# EAGLE design ATEx_2016 (EAGLE 7.5.0)
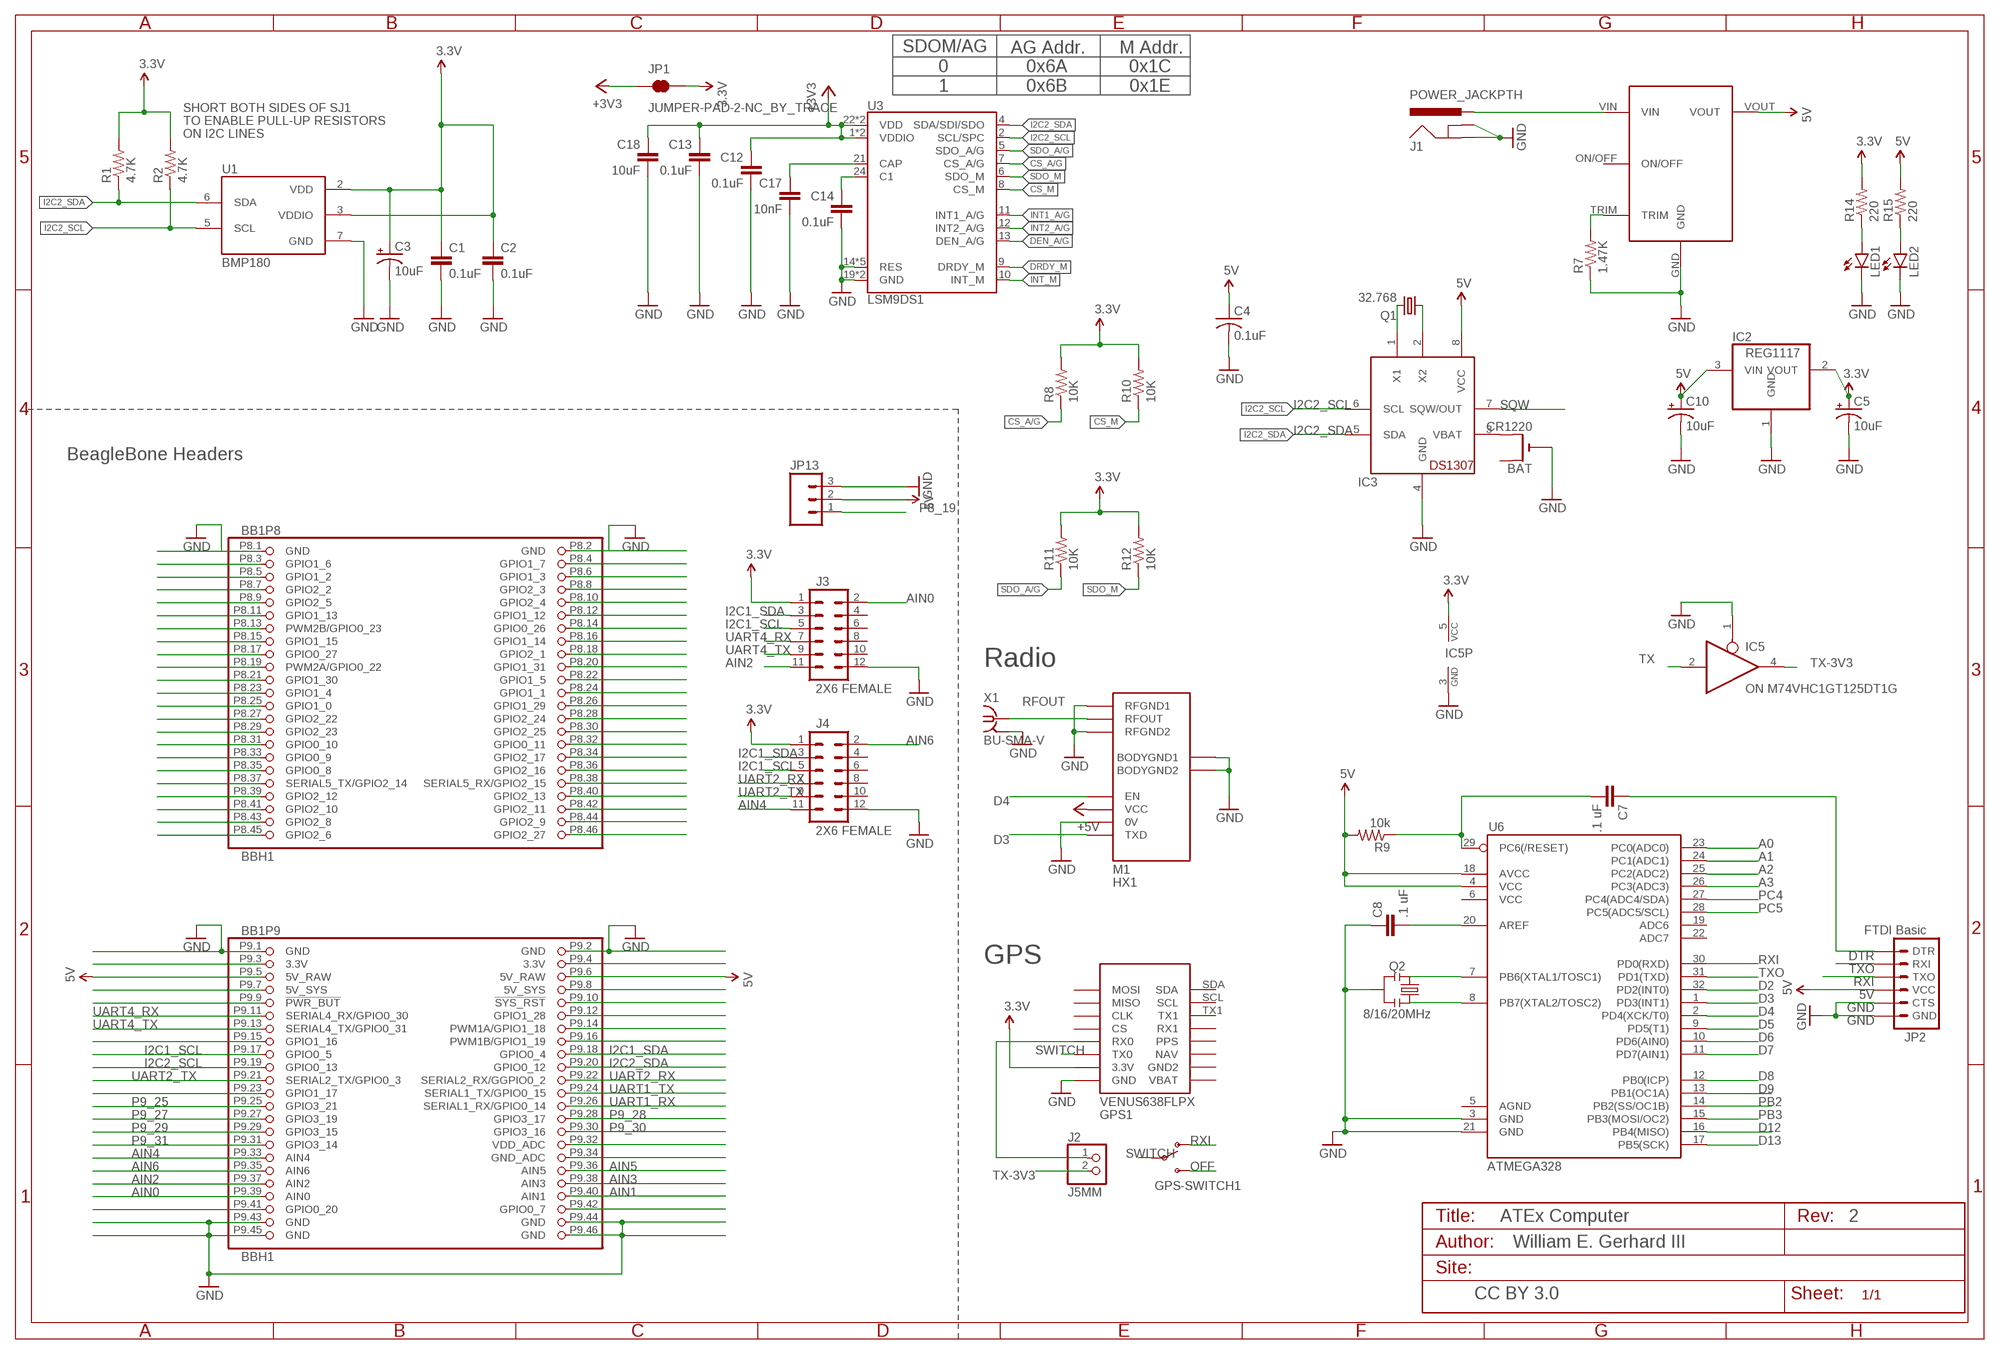
[diagram p0: schematic, sheet 1]

## Parts
BAT  CR1220  CR1220THM  [CR1220-THM]
BB1  BBH1  [BB_CAPE]
C1  0.1uF  CAP0603-CAP  [0603-CAP]
C2  0.1uF  CAP0603-CAP  [0603-CAP]
C3  10uF  10UF-16V-10%(TANT)  [EIA3216]
C4  0.1uF  C-USC0603  [C0603]
C5  10uF  CAP_POL1206  [EIA3216]
C7  .1 uF  CAP0603-CAP  [0603-CAP]
C8  .1 uF  CAP0603-CAP  [0603-CAP]
C10  10uF  CAP_POL1206  [EIA3216]
C12  0.1uF  0.1UF-25V(+80/-20%)(0603)  [0603-CAP]
C13  0.1uF  0.1UF-25V(+80/-20%)(0603)  [0603-CAP]
C14  0.1uF  0.1UF-25V(+80/-20%)(0603)  [0603-CAP]
C17  10nF  10NF/10000PF-50V-10%(0603)  [0603-CAP]
C18  10uF  10UF-6.3V-20%(0603)  [0603-CAP]
GPS1  VENUS638FLPX  [VENUS638FLPX]
GPS-SWITCH1  SWITCH-SPSTPTH  [SWITCH-SPDT]
IC2  REG1117  [SOT223]
IC3  DS1307  [DIL08]
IC5  ON M74VHC1GT125DT1G  74AHC1G125DBV  [SOT23-5]
J1  POWER_JACKPTH  [POWER_JACK_PTH]
J2  J5MM  PINHD-1X2  [1X02]
J3  2X6 FEMALE  M06X2PTH_FEMALE  [2X6]
J4  2X6 FEMALE  M06X2PTH_FEMALE  [2X6]
JP1  JUMPER-PAD-2-NC_BY_TRACE  [PAD-JUMPER-2-NC_BY_TRACE_YES_SILK]
JP2  FTDI Basic  ARDUINO_SERIAL_PROGRAMPTH  [1X06]
JP13  M03PTH  [1X03]
LED1  LED-FKIT-1206  [FKIT-LED-1206]
LED2  LED-FKIT-1206  [FKIT-LED-1206]
M1  HX1  [HX1]
Q1  32.768  CRYTALTC38H  [TC38H]
Q2  8/16/20MHz  RESONATORSMD  [RESONATOR-SMD]
R1  4.7K  RESISTOR0603-RES  [0603-RES]
R2  4.7K  RESISTOR0603-RES  [0603-RES]
R7  1.47K  R-US_R0603  [R0603]
R8  10K  10KOHM-1/10W-1%(0603)0603  [0603-RES]
R9  10k  RESISTOR0603-RES  [0603-RES]
R10  10K  10KOHM-1/10W-1%(0603)0603  [0603-RES]
R11  10K  10KOHM-1/10W-1%(0603)0603  [0603-RES]
R12  10K  10KOHM-1/10W-1%(0603)0603  [0603-RES]
R14  220  R0603  [R0603]
R15  220  R0603  [R0603]
U1  BMP180  [BMP180]
U3  LSM9DS1  [LGA24-8X4]
U6  ATMEGA328  ATMEGA168  [TQFP32-08]
U$1  DNT12S0A0S03NFA  [SMD]
X1  BU-SMA-V  [BU-SMA-V]

## Nets
3.3V [vcc]: C1.1 C2.1 C3.A(+) C5.A(+) GPS1.3.3V IC2.2(VOUT) IC5.5(VCC) J3.1 J4.1 JP1.2 R1.2 R2.2 R8.2 R10.2 R11.2 R12.2 R14.2 U1.2(VDD) U1.3(VDDIO)
3VOLT: LED1.A R14.1
5V [vcc]: BB1.P9.5(P9:5V_RAW) BB1.P9.6(P9:5V_RAW) C4.1 C10.A(+) IC2.3(VIN) IC3.8(VCC) JP2.4(VCC) JP13.2 R9.2 R15.2 U6.4(VCC) U6.18(AVCC) U$1.VOUT
5VOLT: LED2.A R15.1
+3V3: C12.1 C13.1 C18.1 JP1.1 U3.1(VDDIO) U3.3(VDDIO) U3.22(VDD) U3.23(VDD)
+5V: M1.VCC
A0: U6.23(PC0(ADC0))
A1: U6.24(PC1(ADC1))
A2: U6.25(PC2(ADC2))
A3: U6.26(PC3(ADC3))
AIN0: BB1.P9.39(P9:AIN0) J3.2
AIN1: BB1.P9.40(P9:AIN1)
AIN2: BB1.P9.37(P9:AIN2) J3.11
AIN3: BB1.P9.38(P9:AIN3)
AIN4: BB1.P9.33(P9:AIN4) J4.11
AIN5: BB1.P9.36(P9:AIN5)
AIN6: BB1.P9.35(P9:AIN6) J4.2
C2: C14.1 U3.24(C1)
CAP1: C17.1 U3.21(CAP)
CS_A/G: R8.1 U3.7(CS_A/G)
CS_M: R10.1 U3.8(CS_M)
D2: U6.32(PD2(INT0))
D3 [RF]: M1.TXD U6.1(PD3(INT1))
D4: M1.EN U6.2(PD4(XCK/T0))
D5: U6.9(PD5(T1))
D6: U6.10(PD6(AIN0))
D7: U6.11(PD7(AIN1))
D8: U6.12(PB0(ICP))
D9: U6.13(PB1(OC1A))
D12: U6.16(PB4(MISO))
D13: U6.17(PB5(SCK))
DEN_A/G: U3.13(DEN_A/G)
DRDY_M: U3.9(DRDY_M)
DTR: C7.1 JP2.1(DTR)
GND [vcc]: BAT.- BB1.P8.1(P8:GND) BB1.P8.2(P8:GND) BB1.P9.1(P9:GND) BB1.P9.2(P9:GND) BB1.P9.43(P9:GND) BB1.P9.44(P9:GND) BB1.P9.45(P9:GND) BB1.P9.46(P9:GND) C1.2 C2.2 C3.C(-) C4.2 C5.C(-) C8.1 C10.C(-) C12.2 C13.2 C14.2 C17.2 C18.2 GPS1.GND IC2.1(GND) IC3.4(GND) IC5.1(OE) J1.GND J1.GNDBREAK J3.12 J4.12 JP2.5(CTS) JP2.6(GND) JP13.3 LED1.C LED2.C M1.0V M1.BODYGND1 M1.BODYGND2 M1.RFGND1 M1.RFGND2 Q2.2 R7.1 U1.7(GND) U3.14(RES) U3.15(RES) U3.16(RES) U3.17(RES) U3.18(RES) U3.19(GND) U3.20(GND) U6.3(GND) U6.21(GND) U$1.GND X1.2(GND)
I2C1_SCL: BB1.P9.17(P9:GPIO0_5) J3.5 J4.5
I2C1_SDA: BB1.P9.18(P9:GPIO0_4) J3.3 J4.3
I2C2_SCL: BB1.P9.19(P9:GPIO0_13) IC3.6(SCL) R2.1 U1.5(SCL) U3.2(SCL/SPC)
I2C2_SDA: BB1.P9.20(P9:GPIO0_12) IC3.5(SDA) R1.1 U1.6(SDA) U3.4(SDA/SDI/SDO)
INT1_A/G: U3.11(INT1_A/G)
INT2_A/G: U3.12(INT2_A/G)
INT_M: U3.10(INT_M)
N$1: BB1.P8.46(P8:GPIO2_27)
N$2: BB1.P8.44(P8:GPIO2_9)
N$3: BB1.P8.42(P8:GPIO2_11)
N$4: BB1.P8.40(P8:GPIO2_13)
N$5: BB1.P8.38(P8:SERIAL5_RX/GPIO2_15)
N$6: BB1.P8.36(P8:GPIO2_16)
N$7: BB1.P8.34(P8:GPIO2_17)
N$8: BB1.P8.32(P8:GPIO0_11)
N$9: BB1.P8.30(P8:GPIO2_25)
N$10: BB1.P8.28(P8:GPIO2_24)
N$11: BB1.P8.26(P8:GPIO1_29)
N$12: BB1.P8.24(P8:GPIO1_1)
N$13 [vcc]: J1.PWR U$1.VIN
N$14: IC5.3(GND) ; supply symbol labelled GND
N$17: BB1.P8.22(P8:GPIO1_5)
N$18: BB1.P8.20(P8:GPIO1_31)
N$19: BB1.P8.18(P8:GPIO2_1)
N$20: BB1.P8.16(P8:GPIO1_14)
N$21: BB1.P8.14(P8:GPIO0_26)
N$22: R7.2 U$1.TRIM
N$23: BB1.P9.4(P9:3.3V)
N$24: BB1.P8.10(P8:GPIO2_4)
N$25: BB1.P8.8(P8:GPIO2_3)
N$26: BB1.P8.6(P8:GPIO1_3)
N$27: BB1.P8.4(P8:GPIO1_7)
N$28: BB1.P8.45(P8:GPIO2_6)
N$29: BB1.P8.43(P8:GPIO2_8)
N$30: BB1.P8.41(P8:GPIO2_10)
N$31: BB1.P8.39(P8:GPIO2_12)
N$32: BB1.P8.37(P8:SERIAL5_TX/GPIO2_14)
N$33: BB1.P8.35(P8:GPIO0_8)
N$34: BB1.P8.33(P8:GPIO0_9)
N$35: BB1.P8.31(P8:GPIO0_10)
N$36: BB1.P8.29(P8:GPIO2_23)
N$37: BB1.P8.27(P8:GPIO2_22)
N$38: BB1.P8.25(P8:GPIO1_0)
N$39: BB1.P8.23(P8:GPIO1_4)
N$40: BB1.P8.21(P8:GPIO1_30)
N$42: BB1.P8.17(P8:GPIO0_27)
N$43: BB1.P8.15(P8:GPIO1_15)
N$44: BB1.P8.13(P8:PWM2B/GPIO0_23)
N$45: Q2.3 U6.7(PB6(XTAL1/TOSC1))
N$46: BB1.P8.9(P8:GPIO2_5)
N$47: BB1.P8.7(P8:GPIO2_2)
N$48: BB1.P8.5(P8:GPIO1_2)
N$49: BB1.P8.3(P8:GPIO1_6)
N$55: Q2.1 U6.8(PB7(XTAL2/TOSC2))
N$56: BB1.P9.3(P9:3.3V)
N$59: BB1.P9.23(P9:GPIO1_17)
N$60: IC3.1(X1) Q1.2
N$62: BB1.P9.15(P9:GPIO1_16)
N$65: BB1.P9.9(P9:!PWR_BUT)
N$66: BB1.P9.7(P9:5V_SYS)
N$71: BB1.P9.34(P9:GND_ADC)
N$72: BB1.P9.32(P9:VDD_ADC)
N$73: GPS1.RX0 J2.1
N$76: C8.2 U6.20(AREF)
N$77: IC3.2(X2) Q1.1
N$78: C7.2 R9.1 U6.29(PC6(/RESET))
N$79: BB1.P9.16(P9:PWM1B/GPIO1_19)
N$80: BB1.P9.14(P9:PWM1A/GPIO1_18)
N$81: BB1.P9.12(P9:GPIO1_28)
N$82: BB1.P9.10(P9:!SYS_RST)
N$83: BB1.P9.8(P9:5V_SYS)
N$88: BAT.+2(+1) IC3.3(VBAT)
OFF: GPS-SWITCH1.3(S)
P8_11: BB1.P8.11(P8:GPIO1_13)
P8_12: BB1.P8.12(P8:GPIO1_12)
P8_19: BB1.P8.19(P8:PWM2A/GPIO0_22) JP13.1
P9_25: BB1.P9.25(P9:GPIO3_21)
P9_27: BB1.P9.27(P9:GPIO3_19)
P9_28: BB1.P9.28(P9:GPIO3_17)
P9_29: BB1.P9.29(P9:GPIO3_15)
P9_30: BB1.P9.30(P9:GPIO3_16)
P9_31: BB1.P9.31(P9:GPIO3_14)
P9_41: BB1.P9.41(P9:GPIO0_20)
P9_42: BB1.P9.42(P9:GPIO0_7)
PB2: U6.14(PB2(SS/OC1B))
PB3: U6.15(PB3(MOSI/OC2))
PC4: U6.27(PC4(ADC4/SDA))
PC5: U6.28(PC5(ADC5/SCL))
RFOUT [RF]: M1.RFOUT X1.1
RXI: GPS-SWITCH1.1(O) JP2.3(TXO) U6.30(PD0(RXD))
SDO_A/G: R11.1 U3.5(SDO_A/G)
SDO_M: R12.1 U3.6(SDO_M)
SQW: IC3.7(SQW/OUT)
SWITCH: GPS1.TX0 GPS-SWITCH1.2(P)
TX: IC5.2(I)
TX-3V3: IC5.4(O) J2.2
TXO: JP2.2(RXI) U6.31(PD1(TXD))
UART1_RX: BB1.P9.26(P9:SERIAL1_RX/GPIO0_14)
UART1_TX: BB1.P9.24(P9:SERIAL1_TX/GPIO0_15)
UART2_RX: BB1.P9.22(P9:SERIAL2_RX/GGPIO0_2) J4.7
UART2_TX: BB1.P9.21(P9:SERIAL2_TX/GPIO0_3) J4.9
UART4_RX: BB1.P9.11(P9:SERIAL4_RX/GPIO0_30) J3.7
UART4_TX: BB1.P9.13(P9:SERIAL4_TX/GPIO0_31) J3.9
Unconnected: BAT.+1(+) GPS1.CLK GPS1.CS GPS1.GND2 GPS1.MISO GPS1.MOSI GPS1.NAV GPS1.PPS GPS1.RX1 GPS1.SCL GPS1.SDA GPS1.TX1 GPS1.VBAT J3.4 J3.6 J3.8 J3.10 J4.4 J4.6 J4.8 J4.10 U6.5(AGND) U6.6(VCC) U6.19(ADC6) U6.22(ADC7) U$1.ON/OFF

## Notes on the sheet
- SDOM/AG | AG Addr. | M Addr.
- 0
  1
- 0x6A
  0x6B
- 0x1C
  0x1E
- SHORT BOTH SIDES OF SJ1
- TO ENABLE PULL-UP RESISTORS
- ON I2C LINES
- BeagleBone Headers
- Radio
- GPS
- ATEx Computer | 2
- William E. Gerhard III
- CC BY 3.0

## Power pins joined to a net without a drawn wire
GND: X1.3(GND) X1.4(GND) X1.5(GND)

## Library data of the parts
BAT = adafruit:CR1220: CR1216/CR1220/CR1225 12mm 3V lithium coin cell Great for battery packup. Both SMT and THM holders. Note the THM package has the ground pads on both sides of the PCB so that the masks are the same - this reduces the cost
BB1 = logic-supply:BBH: BeagleBone header sub-assembly BBH1 outdated, use BBH2 or BBH3 only; PARTNO: BBH1
C1 C2 = SparkFun-Capacitors:CAP: Capacitor Standard 0603 ceramic capacitor, and 0.1" leaded capacitor.
C3 = SparkFun-Capacitors:10UF-16V-10%(TANT): CAP-00811 1206/EIA-3216 Tantalum capacitor; PROD_ID: CAP-00811
C4 = adafruit:C-US: CAPACITOR, American symbol
C5 C10 = SparkFun:CAP_POL: Capacitor Polarized These are standard SMD and PTH capacitors. Normally 10uF, 47uF, and 100uF in electrolytic and tantalum varieties. Always verify the external diameter of the through hole cap, it varies with capacity, voltage, and manufacturer. The EIA devices should be standard.
C7 C8 = SparkFun-Passives:CAP: Capacitor Standard 0603 ceramic capacitor, and 0.1" leaded capacitor.
C12-C14 = SparkFun-Capacitors:0.1UF-25V(+80/-20%)(0603): CAP-00810 Ceramic Standard decoupling cap; PROD_ID: CAP-00810
C17 = SparkFun-Capacitors:10NF/10000PF-50V-10%(0603): CAP-00867; PROD_ID: CAP-00867
C18 = SparkFun-Capacitors:10UF-6.3V-20%(0603): CAP-11015; PROD_ID: CAP-11015
GPS1 = trackuino:VENUS638FLPX
GPS-SWITCH1 = SparkFun:SWITCH-SPST: SPST Switch Simple slide switch. Spark Fun Electronics SKU : COM-00102
IC2 = burr-brown:REG1117: 800mA and 1A Low Dropout (LDO) Positive Regulator 1.8V, 2.5V, 2.85V, 3.3V, 5V, and Adj; MPN: REG1117; OC_FARNELL: 1097566; OC_NEWARK: 14P6981; PARTNO: *
IC3 = adafruit:DS1307: DS1307 Real time clock (RTC) with battery backup ability. Talk to it via i2c
IC5 = 74xx-little-us:74*1G125: Single Bus Buffer Gate with 3-State Output
J1 = SparkFun-Connectors:POWER_JACK: Power Jack This is the standard 5.5mm barrel jack for power. The PTH is the most common, proven, reliable, footprint. The Slot footprint only works if the mill layer is transmitted to the PCB fab house so be warned. Mating wall wart : TOL-00298 (and others); PROD_ID: PRT-00119
J2 = pinhead:PINHD-1X2: PIN HEADER
J3 J4 = SparkFun-Connectors:M06X2; PROD_ID: CONN-12423
JP1 = SparkFun-Passives:JUMPER-PAD-2-NC_BY_TRACE
JP2 = SparkFun:ARDUINO_SERIAL_PROGRAM
JP13 = SparkFun-Connectors:M03: Header 3 Standard 3-pin 0.1" header. Use with straight break away headers (SKU : PRT-00116), right angle break away headers (PRT-00553), swiss pins (PRT-00743), machine pins (PRT-00117), and female headers (PRT-00115). Molex polarized connector foot print use with SKU : PRT-08232 with associated crimp pins and housings.
LED1 LED2 = SparkFun-LED:LED: LEDs Standard schematic elements and footprints for 5mm, 3mm, 1206, and 0603 sized LEDs. 5mm - Spark Fun Electronics SKU : COM-00529 (and others)
M1 = trackuino:HX1
Q1 = crystal:CRYTAL: CRYSTAL
Q2 = SparkFun:RESONATOR: Resonator Small SMD resonator. This is the itty bitty 10/20MHz resonators with built in caps. CSTCE10M0G55 and CSTCE20M0V53. Footprint has been reviewed closely but hasn't been tested yet.
R1 R2 R9 = SparkFun-Passives:RESISTOR: Resistor Basic schematic elements and footprints for 0603, 1206, and PTH resistors.
R7 = resistor:R-US_: RESISTOR, American symbol; PARTNO: *
R8 R10-R12 = SparkFun-Resistors:10KOHM-1/10W-1%(0603): RES-00824; PROD_ID: RES-00824
R14 R15 = logic-supply:R; PARTNO: *
U1 = SparkFun-Sensors:BMP180: BOSCH BMP180 DIGITAL BAROMETRIC PRESSURE SENSOR Web page: http://www.bosch-sensortec.com/en/homepage/products_3/environmental_sensors_1/bmp180_1/bmp180 Datasheet: http://ae-bst.resource.bosch.com/media/products/dokumente/bmp180/BST-BMP180-DS000-09.pdf The BMP180 is the function compatible successor of the BMP085, a new generation of high precision digital pressure sensors for consumer applications. The ultra-low power, low voltage electronics of the BMP180 is optimized for use in mobile phones, PDAs, GPS navigation devices and outdoor equipment. With a low altitude noise of merely 0.25m at fast conversion time, the BMP180 offers superior performance. The I2C interface allows for easy system integration with a microcontroller. The BMP180 is based on piezo-resistive technology for EMC robustness, high accuracy and linearity as well as long term stability. Key features: - Temperature measurement included - I2C interface - Fully calibrated - Pb-free, halogen-free and RoHS compliant, - MSL 1 Basic specs: Pressure range: 300 to 1100hPa (+9000m to -500m relating to sea level) Supply voltage: 1.8 to 3.6V (VDD), 1.62V to 3.6V (VDDIO) Package: LGA package with metal lid Small footprint: 3.6mm x 3.8mm Super-flat: 0.93mm height Low power: 5μA at 1 sample / sec. in standard mode Low noise: 0.06hPa (0.5m) in ultra low power mode, 0.02hPa (0.17m) advanced resolution mode Typical applications: - Enhancement of GPS navigation (dead-reckoning, slope detection, etc.) - In- and out-door navigation - Leisure and sports - Weather forecast - Vertical velocity indication (rise/sink speed)
U3 = LSM9DS1_temp:LSM9DS1: LSM9DS1 3D accelerometer, gyroscope & magnetometer The LSM9DS1 is a system-in-package featuring a 3D digital linear acceleration sensor, a 3D digital angular rate sensor, and a 3D digital magnetic sensor. The LSM9DS1 has a linear acceleration full scale of ±2g/±4g/±8/±16 g, a magnetic field full scale of ±4/±8/±12/±16 gauss and an angular rate of ±245/±500/±2000 dps. The LSM9DS1 includes an I2 C serial bus interface supporting standard and fast mode (100 kHz and 400 kHz) and an SPI serial standard interface. Magnetic, accelerometer and gyroscope sensing can be enabled or set in power-down mode separately for smart power management. The LSM9DS1 is available in a plastic land grid array package (LGA) and it is guaranteed to operate over an extended temperature range from -40 °C to +85 °C.; PROD_ID: IC-12536
U6 = SparkFun:ATMEGA168
U$1 = custom:DNT12S0A0S03NFA
X1 = con-coax:BU-SMA-V: FEMALE SMA CONNECTOR Radiall distributor RS 112-3794; OC_FARNELL: unknown; OC_NEWARK: unknown

## Net classes
1 vcc: width 0.406 mm, drill 0.33 mm
2 sfd: width 0.287 mm
3 RF: width 0.287 mm

## Board
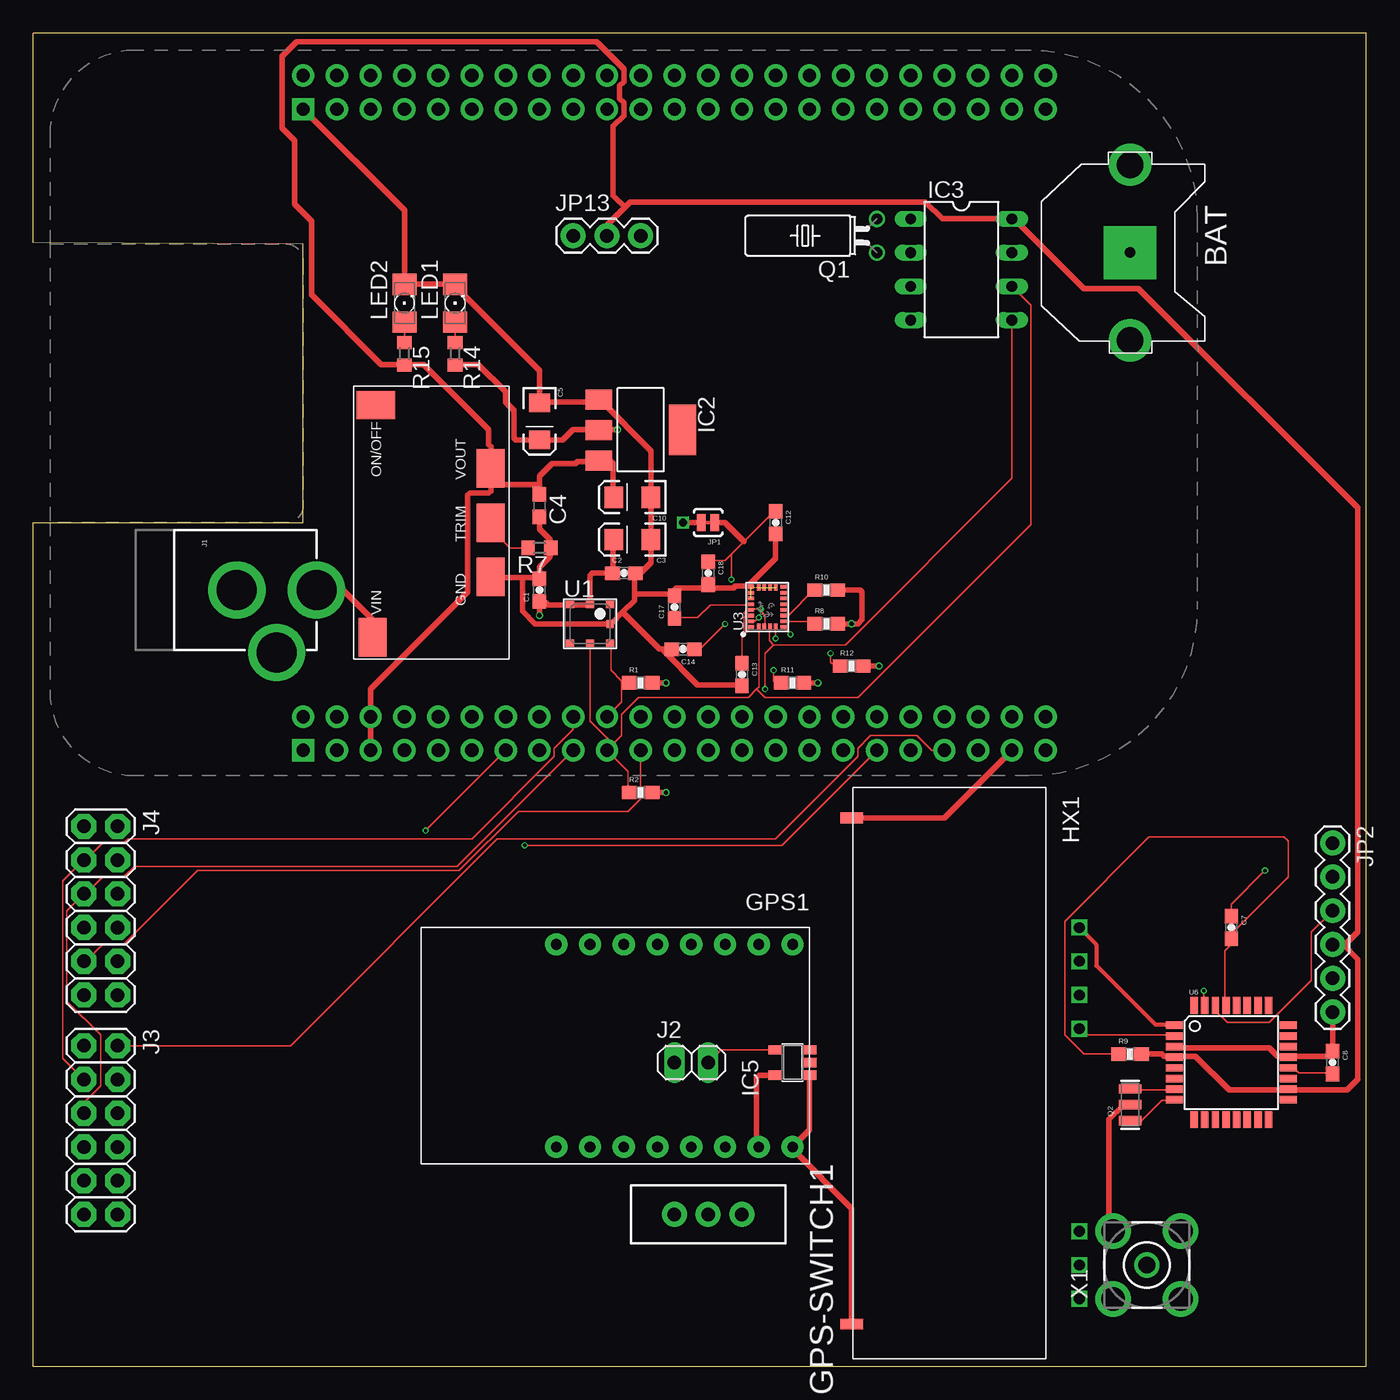
[diagram p1: board, top side]
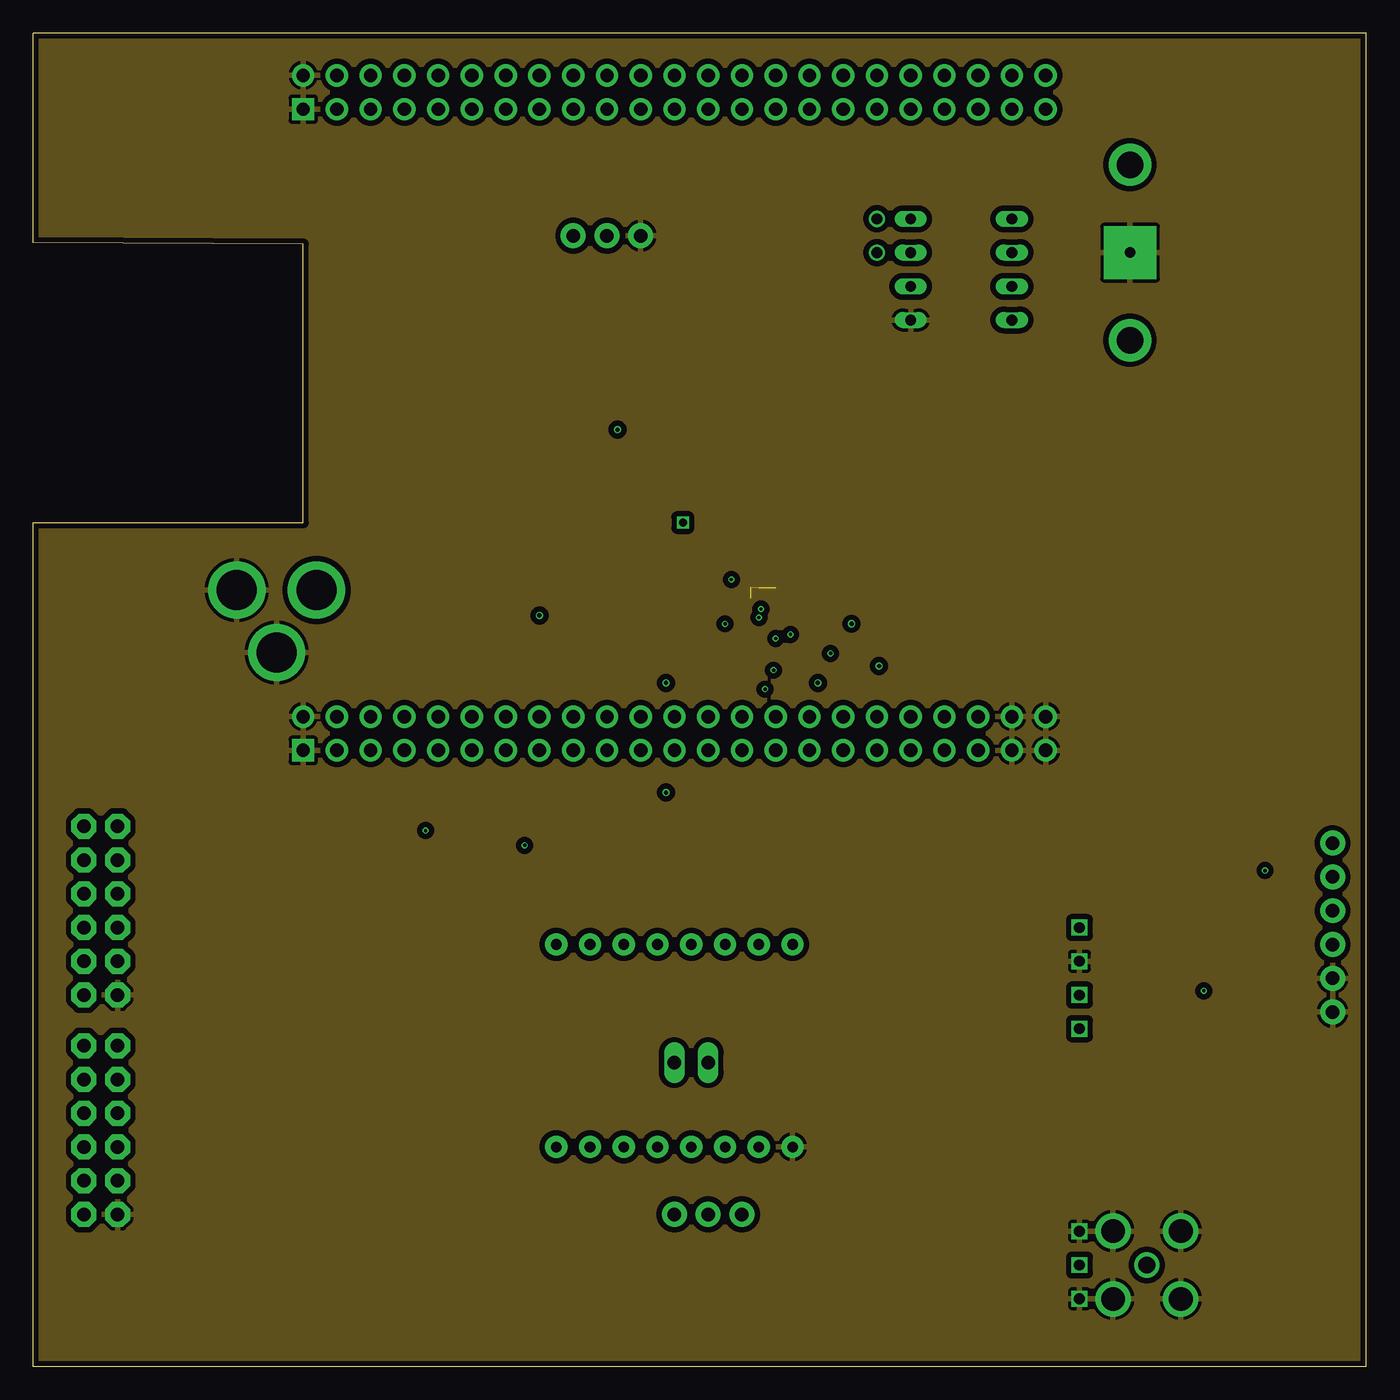
[diagram p2: board, inner layer Route2]
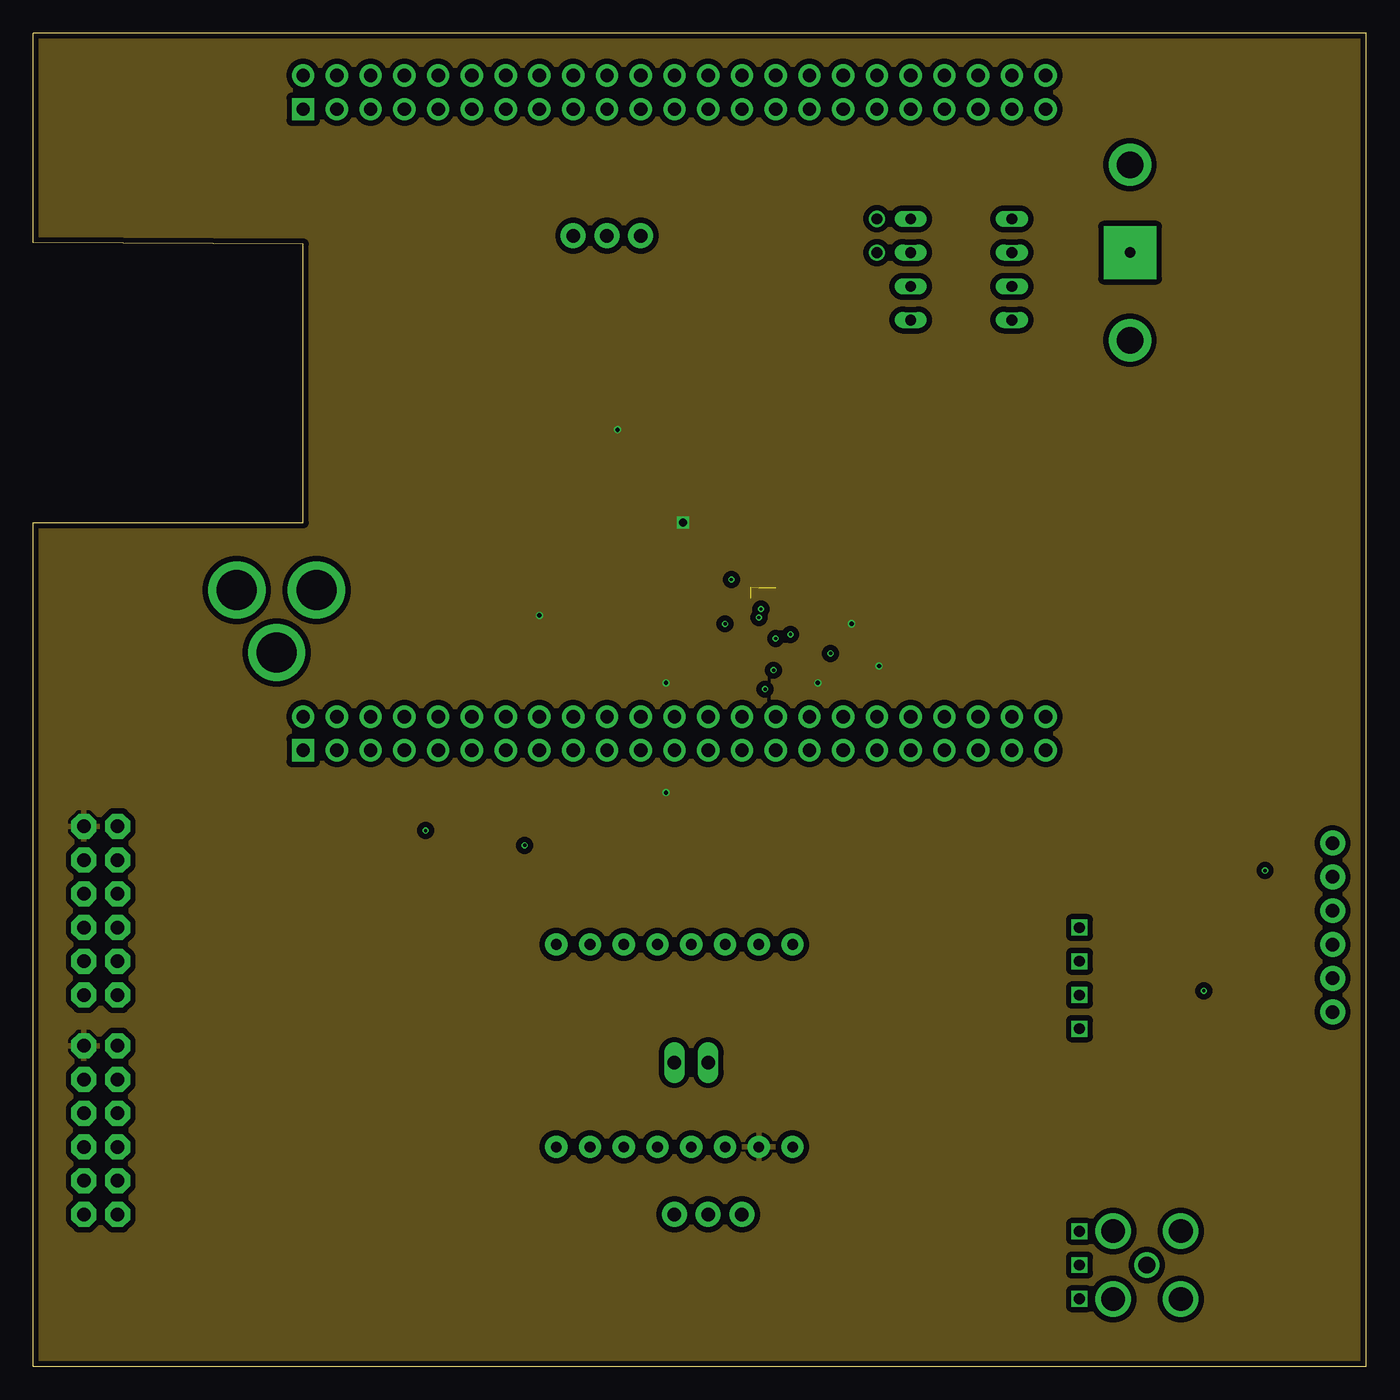
[diagram p3: board, inner layer Route15]
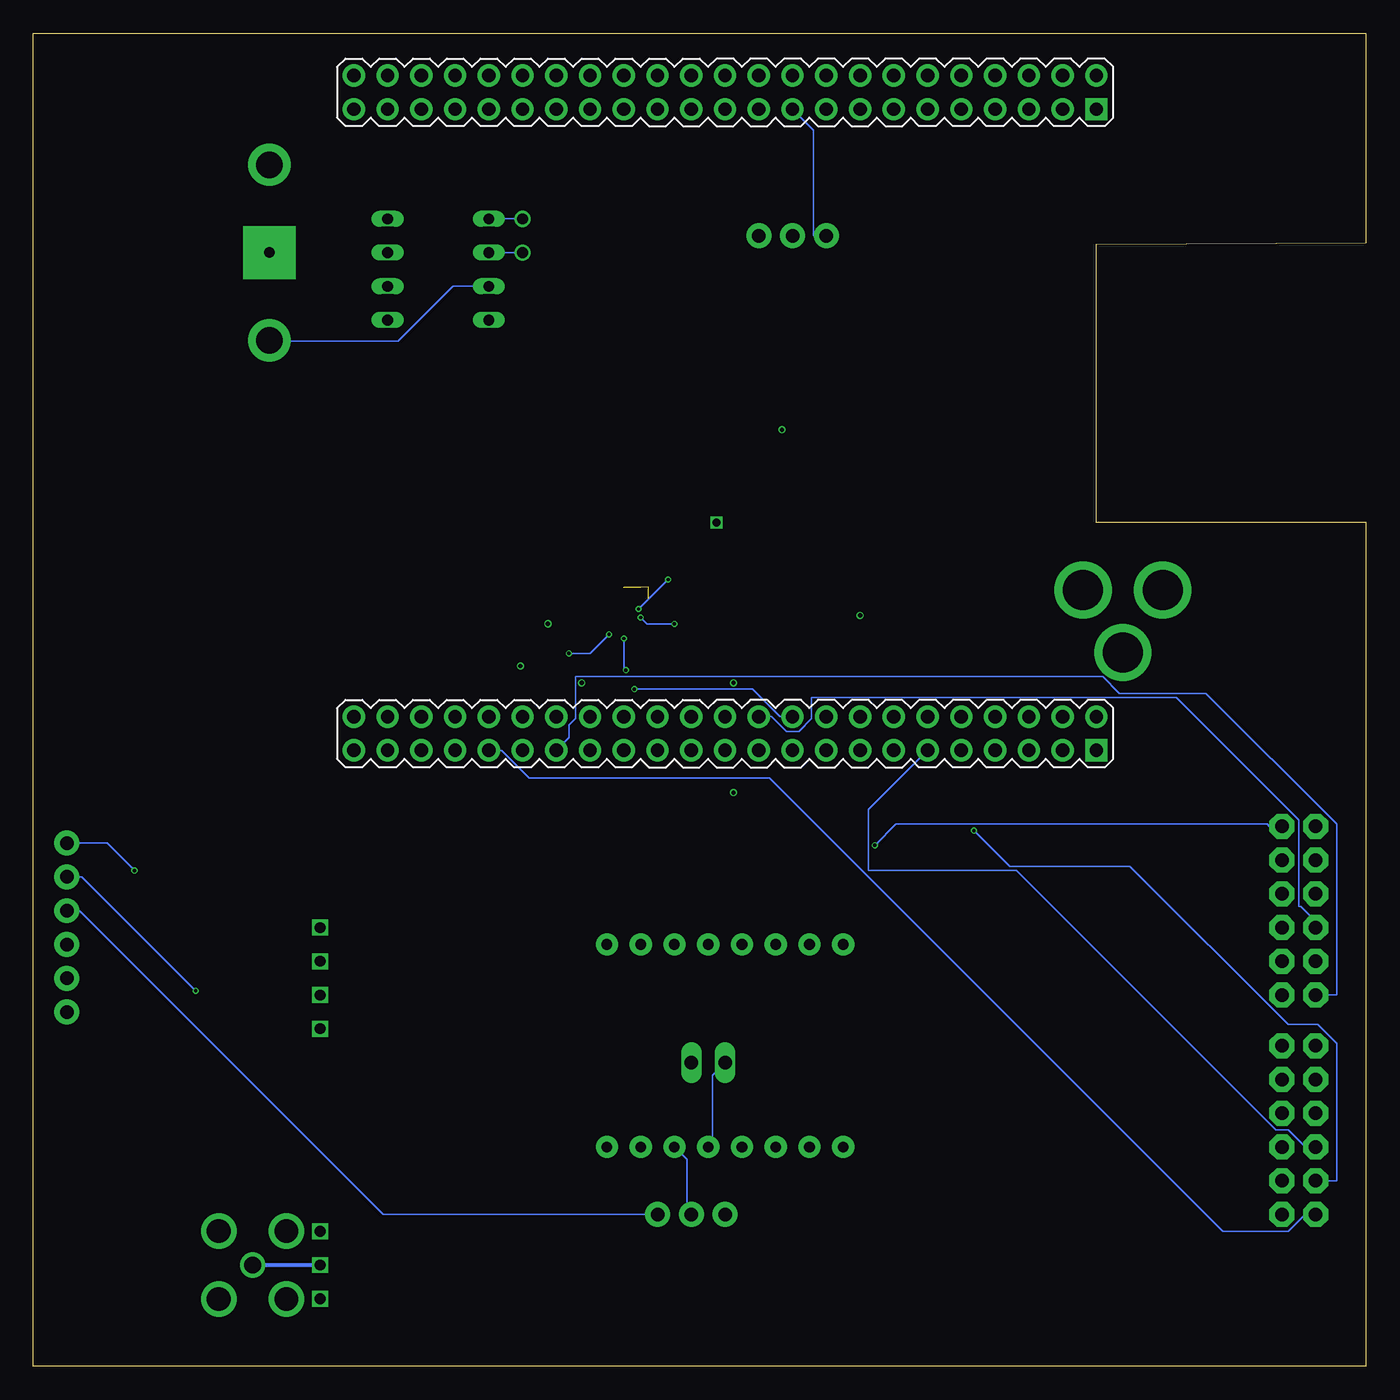
[diagram p4: board, bottom side, seen from below]

Size 100.33 x 100.33 mm. Coordinates in mm from the lower left corner, seen from the top.
Outline: 0,0 100.33,0 100.33,100.33 0,100.33 0,84.58 20.32,84.45 20.32,63.5 0,63.5 0,0
Copper layers (1*2*15*16): Top 0.035559375mm / dielectric 0.17018125mm / Route2 0.01778125mm / dielectric 47mil / Route15 0.01778125mm / dielectric 0.17018125mm / Bottom 0.035559375mm
Design rules "OSHPark-4layer": minimum track width 5mil, minimum drill 10mil, track to track 5mil, track to pad 5mil, pad to pad 5mil, via to via 5mil, smd to smd 5mil, copper to edge 15mil, drill to drill 6mil, minimum pad ring 4mil, minimum via ring 4mil, stop-mask expansion 2.5mil, vias tented up to drill 0mil, thermal gap 10mil

### Footprints (pad centres in the part's own frame; a part is rotated, then mirrored left to right if it is on the bottom)
CR1220-THM = drill 2 pad 3.175: +1 -6.604,0; +2 6.604,0 | drill 0.8 pad 3.962 square: - 0,0
BB_CAPE = drill 1 pad 1.676 square: P8.1 4.445,19.05; P9.1 52.705,19.05 | drill 1 pad 1.676: P8.2 1.905,19.05; P8.3 4.445,21.59; P8.4 1.905,21.59; P8.5 4.445,24.13; P8.6 1.905,24.13; P8.7 4.445,26.67; P8.8 1.905,26.67; P8.9 4.445,29.21; P8.10 1.905,29.21; P8.11 4.445,31.75; P8.12 1.905,31.75; P8.13 4.445,34.29; P8.14 1.905,34.29; P8.15 4.445,36.83; P8.16 1.905,36.83; P8.17 4.445,39.37; P8.18 1.905,39.37; P8.19 4.445,41.91; P8.20 1.905,41.91; P8.21 4.445,44.45; P8.22 1.905,44.45; P8.23 4.445,46.99; P8.24 1.905,46.99; P8.25 4.445,49.53; P8.26 1.905,49.53; P8.27 4.445,52.07; P8.28 1.905,52.07; P8.29 4.445,54.61; P8.30 1.905,54.61; P8.31 4.445,57.15; P8.32 1.905,57.15; P8.33 4.445,59.69; P8.34 1.905,59.69; P8.35 4.445,62.23; P8.36 1.905,62.23; P8.37 4.445,64.77; P8.38 1.905,64.77; P8.39 4.445,67.31; P8.40 1.905,67.31; P8.41 4.445,69.85; P8.42 1.905,69.85; P8.43 4.445,72.39; P8.44 1.905,72.39; P8.45 4.445,74.93; P8.46 1.905,74.93; P9.2 50.165,19.05; P9.3 52.705,21.59; P9.4 50.165,21.59; P9.5 52.705,24.13; P9.6 50.165,24.13; P9.7 52.705,26.67; P9.8 50.165,26.67; P9.9 52.705,29.21; P9.10 50.165,29.21; P9.11 52.705,31.75; P9.12 50.165,31.75; P9.13 52.705,34.29; P9.14 50.165,34.29; P9.15 52.705,36.83; P9.16 50.165,36.83; P9.17 52.705,39.37; P9.18 50.165,39.37; P9.19 52.705,41.91; P9.20 50.165,41.91; P9.21 52.705,44.45; P9.22 50.165,44.45; P9.23 52.705,46.99; P9.24 50.165,46.99; P9.25 52.705,49.53; P9.26 50.165,49.53; P9.27 52.705,52.07; P9.28 50.165,52.07; P9.29 52.705,54.61; P9.30 50.165,54.61; P9.31 52.705,57.15; P9.32 50.165,57.15; P9.33 52.705,59.69; P9.34 50.165,59.69; P9.35 52.705,62.23; P9.36 50.165,62.23; P9.37 52.705,64.77; P9.38 50.165,64.77; P9.39 52.705,67.31; P9.40 50.165,67.31; P9.41 52.705,69.85; P9.42 50.165,69.85; P9.43 52.705,72.39; P9.44 50.165,72.39; P9.45 52.705,74.93; P9.46 50.165,74.93
0603-CAP = smd 1.1 x 1: 1 -0.85,0; 2 0.85,0
EIA3216 = smd 1.4 x 1.6: A 1.4,0; C -1.4,0
C0603 = smd 1.1 x 1: 1 -0.85,0; 2 0.85,0
VENUS638FLPX = drill 0.8 pad 1.676: 3.3V 3.81,16.51; CLK 13.97,16.51; CS 11.43,16.51; GND 1.27,16.51; GND2 3.81,1.27; MISO 16.51,16.51; MOSI 19.05,16.51; NAV 6.35,1.27; PPS 8.89,1.27; RX0 8.89,16.51; RX1 11.43,1.27; SCL 16.51,1.27; SDA 19.05,1.27; TX0 6.35,16.51; TX1 13.97,1.27; VBAT 1.27,1.27
SWITCH-SPDT = drill 1.016 pad 1.88: 1 0,2.54; 2 0,0; 3 0,-2.54
SOT223 = smd 1.499 x 2.007: 1 -2.261,-3.15; 2 0.025,-3.15; 3 2.311,-3.15 | smd 3.81 x 2.007: 4 0,3.15
DIL08 = drill 0.813 long: 1 -3.81,-3.81; 2 -1.27,-3.81; 3 1.27,-3.81; 4 3.81,-3.81; 5 3.81,3.81; 6 1.27,3.81; 7 -1.27,3.81; 8 -3.81,3.81
SOT23-5 = smd 0.69 x 0.99: 1 -0.95,-1.29; 2 0,-1.29; 3 0.95,-1.29; 4 0.95,1.3; 5 -0.95,1.3
POWER_JACK_PTH = drill 2.997 pad 4.318: GND 0,7.7; GNDBREAK 4.7,10.7; PWR 0,13.7
1X02 = drill 1.016 long: 1 -1.27,0; 2 1.27,0
2X6 = drill 1.016 pad 1.88 octagon: 1 0,0; 2 0,2.54; 3 2.54,0; 4 2.54,2.54; 5 5.08,0; 6 5.08,2.54; 7 7.62,0; 8 7.62,2.54; 9 10.16,0; 10 10.16,2.54; 11 12.7,0; 12 12.7,2.54
PAD-JUMPER-2-NC_BY_TRACE_YES_SILK = smd 0.635 x 1.27: 1 -0.508,0; 2 0.508,0
1X06 = drill 1.016 pad 1.88: 1 0,0; 2 2.54,0; 3 5.08,0; 4 7.62,0; 5 10.16,0; 6 12.7,0
1X03 = drill 1.016 pad 1.88: 1 0,0; 2 2.54,0; 3 5.08,0
FKIT-LED-1206 = smd 1.6 x 1.803: A -1.422,0; C 1.422,0
HX1 = drill 0.8 square: 0V 25.4,-8.89; EN 20.32,-8.89; RFGND1 0,-8.89; RFGND2 5.08,-8.89; RFOUT 2.54,-8.89; TXD 27.94,-8.89; VCC 22.86,-8.89 | smd 0.813 x 1.676: BODYGND1 -1.905,8.255; BODYGND2 36.195,8.255
TC38H = drill 0.813: 1 -1.27,0; 2 1.27,0
RESONATOR-SMD = smd 0.7 x 1.7: 1 -1.2,0; 2 0,0; 3 1.2,0
0603-RES = smd 1.1 x 1: 1 -0.85,0; 2 0.85,0
R0603 = smd 1 x 1.1: 1 -0.85,0; 2 0.85,0
BMP180 = smd 0.6 x 0.5: 1 1.5,1.45; 2 0,1.45; 3 -1.5,1.45; 4 -1.5,-1.45; 5 0,-1.45; 6 1.5,-1.45 | smd 0.5 x 0.6: 7 1.5,0
LGA24-8X4 = smd 0.27 x 0.45: 1 -1.505,1.225; 6 -1.505,-1.225; 7 -1.075,-1.225; 8 -0.645,-1.225; 9 -0.215,-1.225; 10 0.215,-1.225; 11 0.645,-1.225; 12 1.075,-1.225; 13 1.505,-1.225; 18 1.505,1.225; 19 1.075,1.225; 20 0.645,1.225; 21 0.215,1.225; 22 -0.215,1.225; 23 -0.645,1.225; 24 -1.075,1.225 | smd 0.45 x 0.27: 2 -1.475,0.645; 3 -1.475,0.215; 4 -1.475,-0.215; 5 -1.475,-0.645; 14 1.475,-0.645; 15 1.475,-0.215; 16 1.475,0.215; 17 1.475,0.645
TQFP32-08 = smd 1.27 x 0.559: 1 -4.293,2.8; 2 -4.293,2; 3 -4.293,1.2; 4 -4.293,0.4; 5 -4.293,-0.4; 6 -4.293,-1.2; 7 -4.293,-2; 8 -4.293,-2.8; 17 4.293,-2.8; 18 4.293,-2; 19 4.293,-1.2; 20 4.293,-0.4; 21 4.293,0.4; 22 4.293,1.2; 23 4.293,2; 24 4.293,2.8 | smd 0.559 x 1.27: 9 -2.8,-4.293; 10 -2,-4.293; 11 -1.2,-4.293; 12 -0.4,-4.293; 13 0.4,-4.293; 14 1.2,-4.293; 15 2,-4.293; 16 2.8,-4.293; 25 2.8,4.293; 26 2,4.293; 27 1.2,4.293; 28 0.4,4.293; 29 -0.4,4.293; 30 -1.2,4.293; 31 -2,4.293; 32 -2.8,4.293
SMD = smd 2.896 x 2.108: GND 4.064,10.287; TRIM 0,10.287; VIN 8.636,1.397; VOUT -4.064,10.287 | smd 2.108 x 2.896: ON/OFF -8.839,1.651
BU-SMA-V = drill 1.27: 1 0,0 | drill 1.778: 2 -2.55,2.55; 3 2.55,2.55; 4 2.55,-2.55; 5 -2.55,-2.55

### Placement (x,y rotation side)
BAT  82.55,83.82 270 top
BB1  1.27,99.06 270 top
C1  38.1,58.42 90 top
C2  44.45,59.69 0 top
C3  45.09,62.23 180 top
C4  38.1,64.77 270 top
C5  38.1,71.12 270 top
C7  90.17,33.02 270 top
C8  97.79,22.86 270 top
C10  45.09,65.41 180 top
C12  55.88,63.5 270 top
C13  53.34,52.07 270 top
C14  48.9,53.98 180 top
C17  48.26,57.15 90 top
C18  50.8,59.69 270 top
GPS1  58.42,33.02 180 top
GPS-SWITCH1  50.8,11.43 270 top
IC2  45.72,70.48 270 top
IC3  69.85,82.55 270 top
IC5  57.15,22.86 90 top
J1  7.62,58.42 270 top
J2  49.53,22.86 0 top
J3  3.81,24.13 270 top
J4  3.81,40.64 270 top
JP1  50.8,63.5 180 top
JP2  97.79,39.37 270 top
JP13  40.64,85.09 0 top
LED1  31.75,80.01 90 top
LED2  27.94,80.01 90 top
M1  69.85,5.08 90 top
Q1  63.5,85.09 90 top
Q2  82.55,19.68 90 top
R1  45.72,51.44 0 top
R2  45.72,43.18 0 top
R7  38.1,61.59 180 top
R8  59.69,55.88 0 top
R9  82.55,23.5 0 top
R10  59.69,58.42 0 top
R11  57.15,51.44 0 top
R12  61.59,52.7 0 top
R14  31.75,76.2 270 top
R15  27.94,76.2 270 top
U1  41.91,55.88 0 top
U3  55.24,57.15 90 top
U6  90.17,22.86 0 top
U$1  24.13,63.5 270 top
X1  83.82,7.62 90 top

### Tracks (layer width: path | path; a pad name or v marks a point on that pad's centre or on a via)
3.3V  (via drill 0.33, 0.6)
  Top 0.406: R14.2 31.75,75.41 33.5,75.41 35.56,73.34 35.56,72.55 36.2,71.91 36.2,69.85 36.35,69.69 38.1,69.69 C5.A 38.26,69.69 39.85,69.69 40.64,70.48 42.55,70.48 IC2.2 42.7,70.48 v43.97,70.48 | C3.A 43.66,62.23 43.66,59.69 C2.1 42.07,59.69 41.91,59.53 U1.2 41.91,57.31 40.48,57.31 U1.3 40.32,57.31 38.73,57.31 38.58,57.47 38.1,57.47 C1.1 v38.1,56.52 | R8.2 v61.59,55.88 62.07,55.88 62.39,56.2 62.39,58.26 62.23,58.42 R10.2 | GPS1.3.3V 54.45,16.67 54.45,21.75 54.61,21.91 55.72,21.91 IC5.5 | v47.62,43.18 R2.2 | v47.62,51.44 R1.2 | v59.05,51.44 R11.2 | v63.66,52.7 R12.2 | v48.9,63.5 JP1.2
  pour Route15 (isolate 0.406, rank 2): 0,-1.27 0,100.33 101.6,100.33 101.6,-1.27
3VOLT
  Top 0.127: LED1.A R14.1
5V
  Top 0.406: 38.1,66.36 38.1,66.99 39.05,67.94 40.8,67.94 40.96,68.1 42.55,68.1 IC2.3 42.7,68.1 43.5,68.1 43.66,67.94 43.66,65.41 C10.A | 38.1,66.36 C4.1 | BB1.P9.5 BB1.P9.6 25.4,50.96 32.7,58.26 32.7,65.56 32.86,65.72 34.29,65.72 34.45,65.88 34.45,67.47 U$1.VOUT | U$1.VOUT 34.45,67.63 34.45,69.22 34.29,69.37 34.29,70.48 29.37,75.41 27.94,75.41 R15.2 27.78,75.41 26.19,75.41 20.95,80.64 20.95,86.2 19.68,87.47 19.68,92.23 18.73,93.19 18.73,98.58 19.84,99.69 42.39,99.69 44.45,97.63 44.45,96.68 44.13,96.36 44.13,95.41 44.45,95.09 44.45,94.14 43.66,93.34 43.66,88.11 44.53,87.23 | 38.1,66.36 34.61,66.36 U$1.VOUT | R9.2 84.93,23.5 85.09,23.34 85.72,23.34 U6.4 86.04,23.34 87.47,23.34 90.01,20.8 94.46,20.8 U6.18 94.61,20.8 98.9,20.8 99.69,21.59 99.69,30.64 98.58,31.75 | 98.58,31.75 JP2.4 | 44.53,87.23 43.18,85.88 JP13.2 | 44.53,87.23 44.93,87.63 67.15,87.63 68.42,86.36 IC3.8 73.82,86.36 79.06,81.12 83.19,81.12 99.69,64.61 99.69,32.7 98.74,31.75 98.58,31.75
5VOLT
  Top 0.127: LED2.A R15.1
+3V3  (via drill 0.25)
  Top 0.127: 53.66,56.52 53.98,56.52 U3.23 | 53.66,56.52 53.5,56.67 53.82,56.99 53.98,56.99 U3.22 54.13,56.99 54.61,56.99 54.77,56.83 | 54.77,56.83 55.09,56.52 55.09,55.72 U3.3 | 53.5,55.09 53.34,54.93 C13.1 | 53.5,55.09 53.98,55.56 U3.1 | 53.66,56.52 53.5,56.36 53.5,55.09 | 52.55,61.12 53.5,62.07 55.88,64.45 C12.1 | 52.55,61.12 52.07,60.64 50.8,60.64 C18.1 | v54.77,56.99 54.77,56.83 | 52.55,61.12 v52.55,59.21
  Top 0.406: JP1.1 52.07,63.5 53.5,62.07
  Bottom 0.127: v52.55,59.21 v54.77,56.99
AIN0
  Top 0.127: BB1.P9.39 67.63,46.35 66.52,47.47 63.02,47.47 62.07,46.51 62.07,45.88 55.88,39.69 34.92,39.69 19.37,24.13 J3.2
AIN2
  Bottom 0.127: BB1.P9.37 65.09,46.35 63.02,44.29 44.93,44.29 10.79,10.16 5.87,10.16 4.6,11.43 J3.11
AIN4
  Bottom 0.127: BB1.P9.33 60.01,47.31 60.01,48.26 59.53,48.74 59.53,51.91 19.84,51.91 18.57,50.64 12.06,50.64 2.22,40.8 2.22,27.94 J4.11
AIN6  (via drill 0.25)
  Top 0.127: BB1.P9.35 56.36,39.21 v36.99,39.21
  Bottom 0.127: v36.99,39.21 35.4,40.8 7.46,40.8 7.3,40.64 J4.2
C2  (via drill 0.25)
  Top 0.127: v54.61,56.36 54.29,56.04 54.13,56.04 U3.24 | v52.07,55.88 50.16,53.98 C14.1
  Bottom 0.127: v54.61,56.36 54.13,55.88 v52.07,55.88
CAP1
  Top 0.127: U3.21 53.98,57.31 50.96,57.31 50.01,56.36 48.26,56.36 C17.1
CS_A/G
  Top 0.127: R8.1 58.58,55.88 58.42,56.04 56.52,56.04 U3.7
CS_M
  Top 0.127: U3.8 56.52,56.52 56.83,56.52 58.74,58.42 R10.1
D3
  Top 0.287: M1.TXD 80.01,31.75 80.01,30.16 84.45,25.72 85.72,25.72 U6.1
D4
  Top 0.127: M1.EN 79.22,24.92 85.72,24.92 U6.2
DTR  (via drill 0.25)
  Top 0.127: C7.1 90.17,34.77 v92.71,37.31
  Bottom 0.127: v92.71,37.31 94.77,39.37 JP2.1
GND  (6 unrouted)
  Top 0.406: C4.2 38.1,63.02 38.89,62.23 38.89,61.75 R7.1 38.89,61.59 38.89,60.96 38.1,60.17 C1.2 37.94,59.37 36.83,59.37 | 36.83,59.37 34.45,59.37 U$1.GND | 53.98,58.74 52.86,58.74 52.7,58.58 50.8,58.58 C18.2 50.64,58.58 48.42,58.58 48.1,58.26 C17.2 48.26,58.1 45.24,58.1 | 53.98,58.74 U3.18 | C12.2 55.88,60.8 53.98,58.9 53.98,58.74 | 44.37,56.75 45.24,57.63 45.24,58.1 | 44.37,56.75 43.5,55.88 U1.7 37.78,55.88 36.83,56.83 36.83,59.37 | 45.24,58.1 45.24,59.69 C2.2 45.72,59.69 46.51,60.48 46.51,62.07 C3.C 46.51,62.23 46.51,65.41 C10.C 46.51,65.56 46.51,68.9 42.7,72.71 IC2.1 42.55,72.87 42.23,72.55 38.1,72.55 C5.C 38.1,74.93 31.75,81.28 LED1.C LED2.C 27.94,87 BB1.P8.1 | 47.47,53.98 47.15,53.98 44.37,56.75 | 47.47,53.98 C14.2 | C13.2 53.34,51.28 50.01,51.28 47.47,53.82 47.47,53.98 | IC5.1 58.42,21.91 58.42,17.78 GPS1.GND 57.15,16.35 61.59,11.91 M1.BODYGND1 | JP2.6 C8.1 97.95,23.65 97.63,23.34 94.61,23.34 U6.21 94.3,23.34 93.66,23.34 93.03,23.97 85.88,23.97 U6.3 | M1.BODYGND2 68.58,41.27 BB1.P9.43 | Q2.2 82.07,19.68 80.96,18.57 80.96,10.48 X1.3
  pour Route2 (isolate 0.406): 0,0 0,64.77 19.05,64.77 19.05,83.82 -1.27,83.82 -1.27,101.6 102.87,101.6 102.87,93.98 102.87,-2.54 0,-2.54
I2C1_SCL
  Top 0.127: BB1.P9.17 31.91,37.62 7.62,37.62 6.83,36.83 5.24,36.83 3.97,35.56 J4.5 2.54,34.29 2.54,27.46 5.08,24.92 5.08,21.11 3.81,19.84 J3.5
I2C1_SDA
  Top 0.127: BB1.P9.18 40.64,47.94 39.21,46.51 39.21,45.88 33.02,39.69 7.14,39.69 6.83,39.37 5.24,39.37 3.97,38.1 J4.3 2.22,36.51 2.22,23.18 J3.3
I2C2_SCL
  Top 0.127: 54.45,50.96 53.82,50.32 45.56,50.32 44.29,49.05 44.29,47.47 43.66,46.83 | 54.45,50.96 54.61,51.12 54.61,55.56 U3.2 | U1.5 41.91,48.58 43.66,46.83 | 43.66,46.83 BB1.P9.19 44.77,44.77 44.77,43.18 R2.1 | IC3.6 75.09,79.85 75.09,63.34 62.07,50.32 55.09,50.32 54.45,50.96
I2C2_SDA  (via drill 0.25)
  Top 0.127: 44.29,51.59 44.45,51.44 R1.1 | 44.29,51.59 43.5,52.39 43.5,54.29 U1.6 | 44.29,51.59 44.29,50.01 BB1.P9.20 | 55.72,54.29 55.4,54.61 55.4,55.56 U3.4 | 55.72,54.29 61.12,54.29 73.66,66.83 IC3.5 | v55.09,50.96 55.09,53.66 55.72,54.29
  Bottom 0.127: BB1.P9.20 44.13,48.9 46.2,50.96 v55.09,50.96
N$13
  Top 0.406: J1.PWR 23.34,58.42 25.56,56.2 25.56,54.93 U$1.VIN
N$22
  Top 0.127: R7.2 35.88,61.59 34.45,63.02 34.45,63.5 U$1.TRIM
N$45
  Top 0.127: U6.7 85.72,20.8 82.55,20.8 Q2.3
N$55
  Top 0.127: U6.8 85.72,20 84.93,20 83.34,18.41 82.55,18.41 Q2.1
N$60
  Bottom 0.127: IC3.1 Q1.2
N$73
  Bottom 0.127: J2.1 49.21,21.91 49.21,16.51 GPS1.RX0
N$76
  Top 0.127: C8.2 97.79,22.07 95.25,22.07 94.93,22.38 94.61,22.38 U6.20
N$77
  Bottom 0.127: IC3.2 Q1.1
N$78
  Top 0.127: R9.1 79.06,23.5 77.63,24.92 77.63,33.5 83.98,39.85 94.14,39.85 94.46,39.53 94.46,36.83 90.17,32.54 C7.2 90.17,31.75 89.69,31.27 89.69,27.3 U6.29
N$88
  Bottom 0.127: IC3.3 68.74,81.28 72.87,77.15 82.55,77.15 BAT.+2
P8_19
  Bottom 0.127: BB1.P8.19 41.59,93.03 41.59,85.09 JP13.1
RFOUT
  Bottom 0.287: X1.1 M1.RFOUT
RXI
  Top 0.127: JP2.3 96.2,32.7 96.2,29.05 93.03,25.88 89.85,25.88 88.9,26.83 88.9,27.15 U6.30
  Bottom 0.127: GPS-SWITCH1.1 73.98,11.43 96.84,34.29 JP2.3
SDO_A/G  (via drill 0.25)
  Top 0.127: v55.88,54.77 55.88,55.56 U3.5 | v55.72,52.39 55.72,51.59 55.88,51.44 R11.1
  Bottom 0.127: v55.88,54.77 55.88,52.39 v55.72,52.39
SDO_M  (via drill 0.25)
  Top 0.127: v56.99,55.09 56.52,55.56 U3.6 | v60.01,53.66 60.01,53.02 60.33,52.7 R12.1
  Bottom 0.127: v56.99,55.09 58.42,53.66 v60.01,53.66
SWITCH
  Bottom 0.127: GPS1.TX0 51.12,15.56 51.12,11.43 GPS-SWITCH1.2
TX-3V3
  Top 0.127: J2.2 51.75,23.81 55.72,23.81 IC5.4
TXO  (via drill 0.25)
  Top 0.127: v88.11,28.26 88.11,27.3 U6.31
  Bottom 0.127: v88.11,28.26 96.68,36.83 JP2.2
UART2_RX
  Bottom 0.127: BB1.P9.22 44.77,48.9 43.66,47.78 42.7,47.78 41.75,48.74 41.75,50.32 14.29,50.32 5.08,41.12 5.08,34.61 4.92,34.61 3.49,33.18 3.49,33.02 J4.7
UART2_TX
  Top 0.127: BB1.P9.21 45.72,42.7 44.77,41.75 36.51,41.75 32.07,37.31 12.38,37.31 6.83,31.75 5.24,31.75 3.97,30.48 J4.9
UART4_RX
  Bottom 0.127: BB1.P9.11 37.47,41.91 37.47,37.31 26.35,37.31 6.83,17.78 5.87,17.78 4.6,16.51 J3.7
UART4_TX  (via drill 0.25)
  Top 0.127: v29.53,40.32 BB1.P9.13
  Bottom 0.127: v29.53,40.32 26.83,37.62 17.78,37.62 5.87,25.72 3.65,25.72 2.22,24.29 2.22,13.97 J3.9